# Altium schematic sheet TMUX130.schdoc: TITRE
size Letter; ApprovedBy: APPROUVÉ PAR; Organization: Cegep Limoilou; Address1: 1300, 8e Avenue; Address2: Québec, QC; Address3: Canada; Address4: G1J 5L5; SheetNumber: 5; SheetTotal: 6
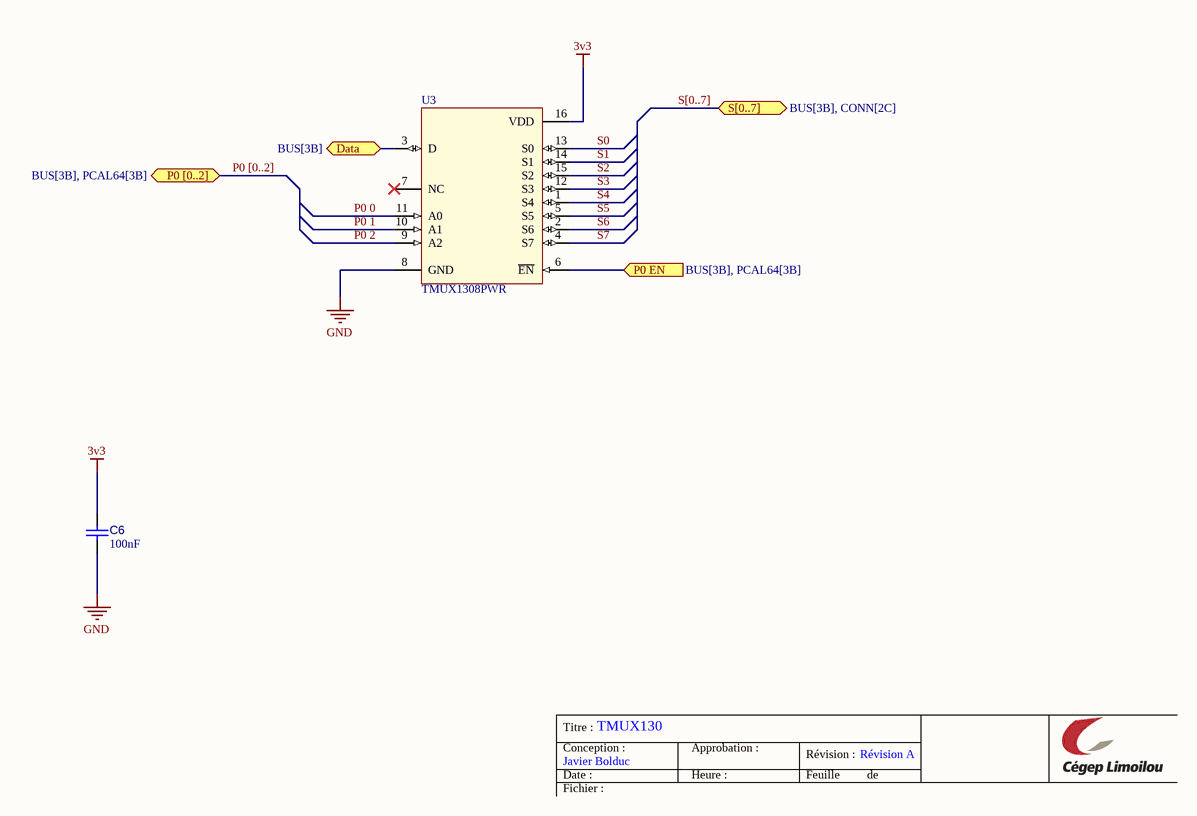
[diagram p0: TMUX130.schdoc]

## Parts
C6  value 100nF  [C_1608[0603]]  (hidden comment: CAP CER 100nF 50V 0603)
U3  TMUX1308PWR  [U_TSSOP65P500X450-16]

## Ports
Data (bidir, see BUS[3B]), P0 [0..2] (bidir, see BUS[3B], PCAL64[3B]), P0 EN (in, see BUS[3B], PCAL64[3B]), S[0..7] (bidir, see BUS[3B], CONN[2C])

## Nets
3v3: C6.2 U3.16(VDD)
GND: C6.1 U3.8(GND)
Data: U3.3(D) ; port Data
P0 0: U3.11(A0)
P0 1: U3.10(A1)
P0 2: U3.9(A2)
P0 EN: U3.6(~{EN}) ; port P0 EN
S0: U3.13(S0)
S1: U3.14(S1)
S2: U3.15(S2)
S3: U3.12(S3)
S4: U3.1(S4)
S5: U3.5(S5)
S6: U3.2(S6)
S7: U3.4(S7)

Not connected (* = marked no-connect by the designer): U3 7(NC)*

## Buses and harness runs
bus P0 [0..2] = port P0 [0..2]
bus S[0..7] = port S[0..7]

## Notes on the sheet
- Titre :
- Conception :
- Date :
- Javier Bolduc
- TMUX130
- Approbation :
- Heure :
- Révision :
- Feuille
- Révision A
- de
- Fichier :

## Library data of the parts
C6 = CAP002: Capacitor type 1; Manufacturer 1: Yageo; Manufacturer Part Number 1: CC0603KRX7R9BB104; LibRef: CAP002; Code CEGEP: COND0143SM; Tolerance: 10%; Dielectric: X7R; Rated Voltage: 50V; Mounting Technology: SMT; Supplier 1: LCSC; Supplier Part Number 1: C14663
U3 = U_TMUX1308PWR: IC MUX 8:1 195OHM 16TSSOP; Manufacturer 1: TI; Manufacturer Part Number 1: TMUX1308PWR; Mounting Technology: SMT; Supplier 1: LCSC; Supplier 2: Digikey; Supplier Part Number 1: C970231; Supplier Part Number 2: 296-TMUX1308PWRCT-ND